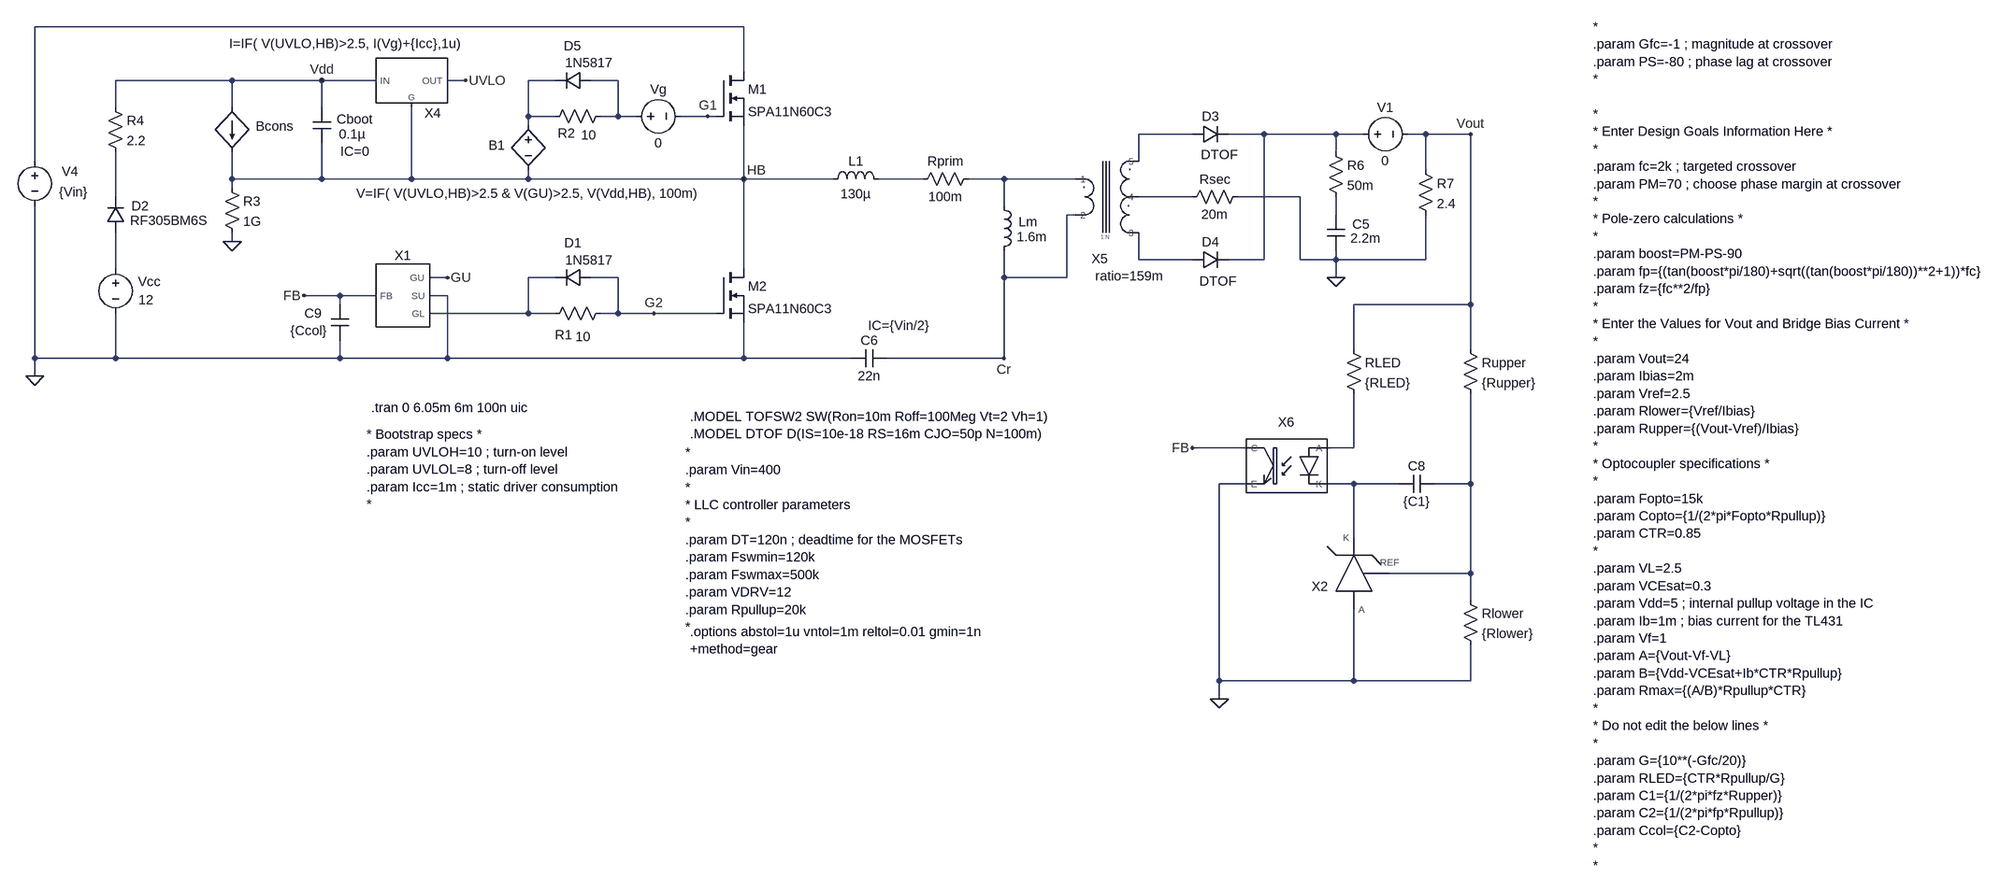
[diagram p0: schematic LLC VM cbc - bootstrap.asc]
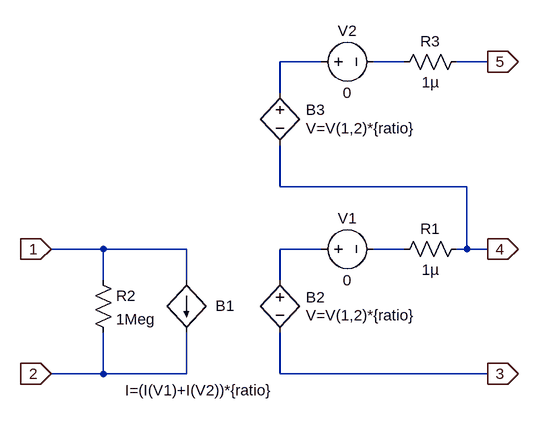
[diagram p1: sub-circuit xfmr_ctap.asc]
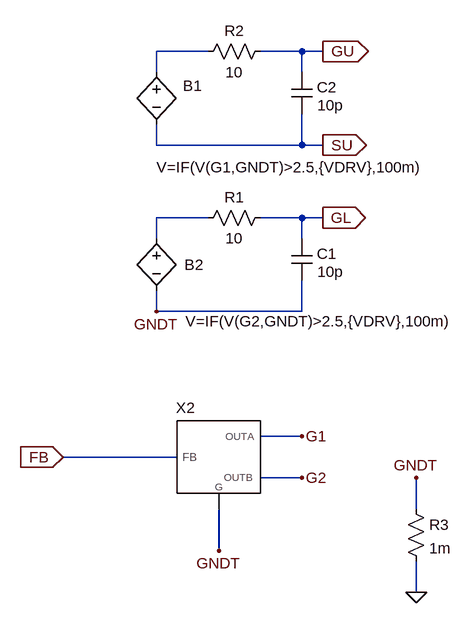
[diagram p2: sub-circuit generic_llc_vm.asc]
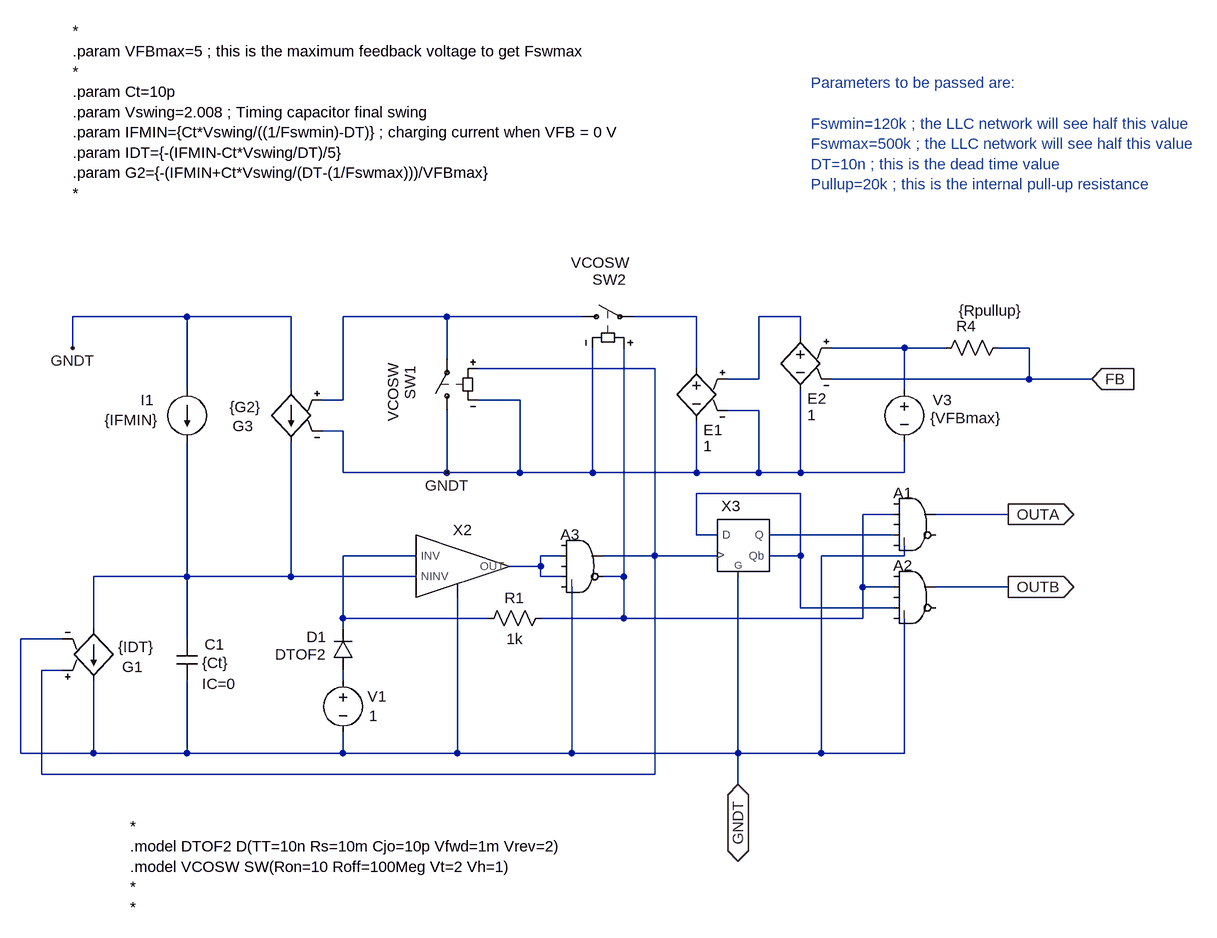
[diagram p3: sub-circuit vco_pulldown_subckt.asc]
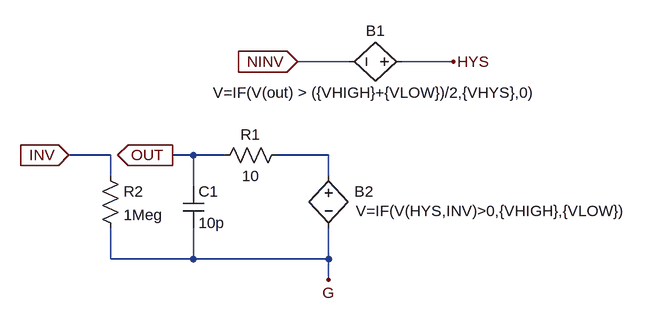
[diagram p4: sub-circuit comptof_g.asc]
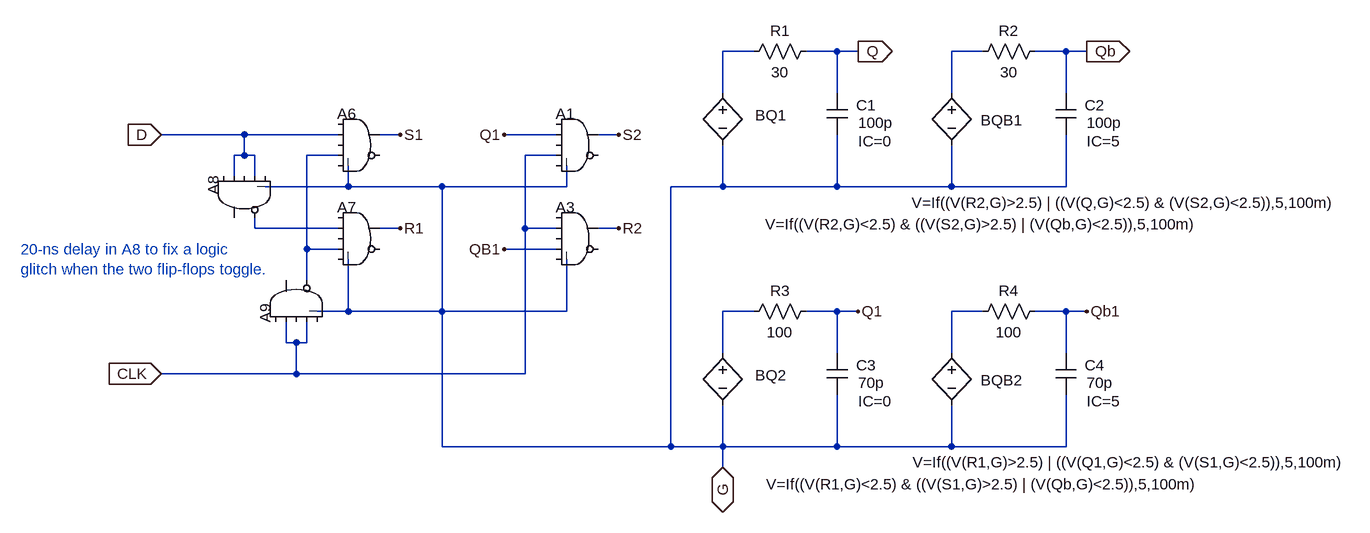
[diagram p5: sub-circuit d_flipflop_g.asc]
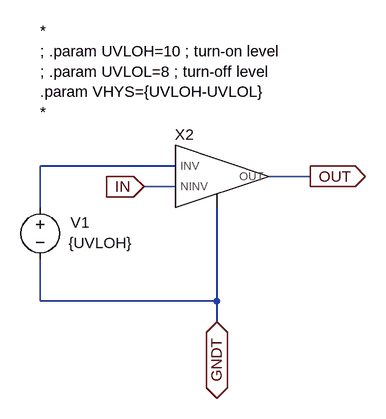
[diagram p6: sub-circuit uvlo.asc]
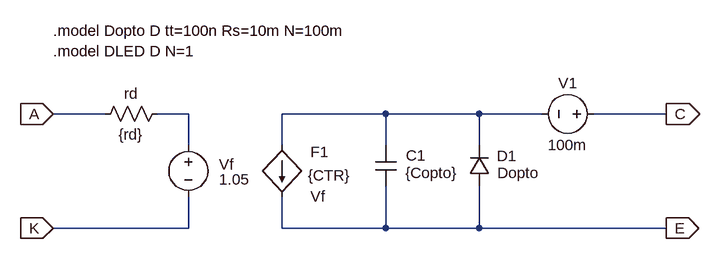
[diagram p7: sub-circuit optotof.asc]
LLC VM cbc - bootstrap.asc, the LTspice schematic file:
Version 4.1
SHEET 1 3260 680
WIRE -1008 -832 -2272 -832
WIRE -1008 -752 -1008 -832
WIRE -1920 -736 -2128 -736
WIRE -1760 -736 -1920 -736
WIRE -1664 -736 -1760 -736
WIRE -1504 -736 -1536 -736
WIRE -1344 -736 -1392 -736
WIRE -1232 -736 -1280 -736
WIRE -2128 -688 -2128 -736
WIRE -1920 -688 -1920 -736
WIRE -1760 -688 -1760 -736
WIRE -1392 -672 -1392 -736
WIRE -1344 -672 -1392 -672
WIRE -1232 -672 -1232 -736
WIRE -1232 -672 -1264 -672
WIRE -1200 -672 -1232 -672
WIRE -1072 -672 -1120 -672
WIRE -1056 -672 -1072 -672
WIRE -1392 -656 -1392 -672
WIRE -208 -640 -304 -640
WIRE -80 -640 -144 -640
WIRE 48 -640 -80 -640
WIRE 96 -640 48 -640
WIRE 208 -640 176 -640
WIRE 288 -640 208 -640
WIRE 48 -608 48 -640
WIRE -2272 -592 -2272 -832
WIRE -304 -592 -304 -640
WIRE 208 -576 208 -640
WIRE -1920 -560 -1920 -608
WIRE -1760 -560 -1760 -624
WIRE -1760 -560 -1920 -560
WIRE -1600 -560 -1600 -688
WIRE -1600 -560 -1760 -560
WIRE -1392 -560 -1392 -576
WIRE -1392 -560 -1600 -560
WIRE -1008 -560 -1008 -656
WIRE -1008 -560 -1392 -560
WIRE -848 -560 -1008 -560
WIRE -688 -560 -768 -560
WIRE -544 -560 -608 -560
WIRE -416 -560 -544 -560
WIRE -1920 -544 -1920 -560
WIRE -2128 -528 -2128 -608
WIRE -208 -528 -304 -528
WIRE -16 -528 -128 -528
WIRE -544 -512 -544 -560
WIRE -416 -496 -432 -496
WIRE 48 -496 48 -528
WIRE -1920 -448 -1920 -464
WIRE -304 -416 -304 -464
WIRE -208 -416 -304 -416
WIRE -80 -416 -80 -640
WIRE -80 -416 -144 -416
WIRE -16 -416 -16 -528
WIRE 48 -416 48 -432
WIRE 48 -416 -16 -416
WIRE 208 -416 208 -496
WIRE 208 -416 48 -416
WIRE -2128 -400 -2128 -464
WIRE -1008 -400 -1008 -560
WIRE -1536 -384 -1568 -384
WIRE -1344 -384 -1392 -384
WIRE -1232 -384 -1280 -384
WIRE -544 -384 -544 -432
WIRE -432 -384 -432 -496
WIRE -432 -384 -544 -384
WIRE 48 -384 48 -416
WIRE -1728 -352 -1792 -352
WIRE -1664 -352 -1728 -352
WIRE -1536 -352 -1568 -352
WIRE -1728 -336 -1728 -352
WIRE 288 -336 288 -640
WIRE 288 -336 80 -336
WIRE -1392 -320 -1392 -384
WIRE -1392 -320 -1568 -320
WIRE -1344 -320 -1392 -320
WIRE -1232 -320 -1232 -384
WIRE -1232 -320 -1264 -320
WIRE -1168 -320 -1232 -320
WIRE -1056 -320 -1168 -320
WIRE 80 -256 80 -336
WIRE 288 -256 288 -336
WIRE -2272 -240 -2272 -512
WIRE -2128 -240 -2128 -320
WIRE -2128 -240 -2272 -240
WIRE -1728 -240 -1728 -272
WIRE -1728 -240 -2128 -240
WIRE -1536 -240 -1536 -352
WIRE -1536 -240 -1728 -240
WIRE -1008 -240 -1008 -304
WIRE -1008 -240 -1536 -240
WIRE -816 -240 -1008 -240
WIRE -544 -240 -544 -384
WIRE -544 -240 -752 -240
WIRE -2272 -208 -2272 -240
WIRE -112 -80 -208 -80
WIRE 80 -80 80 -176
WIRE 80 -80 32 -80
WIRE -112 -16 -160 -16
WIRE 80 -16 32 -16
WIRE 160 -16 80 -16
WIRE 288 -16 288 -176
WIRE 288 -16 224 -16
WIRE 80 80 80 -16
WIRE 288 144 288 -16
WIRE 288 144 144 144
WIRE 288 192 288 144
WIRE -160 336 -160 -16
WIRE 80 336 80 208
WIRE 80 336 -160 336
WIRE 288 336 288 272
WIRE 288 336 80 336
WIRE -160 368 -160 336
FLAG -1792 -352 FB
FLAG 48 -384 0
FLAG 288 -640 Vout
FLAG -1008 -560 HB
FLAG -544 -240 Cr
FLAG -2272 -208 0
FLAG -208 -80 FB
FLAG -160 368 0
FLAG -1536 -384 GU
FLAG -1760 -736 Vdd
FLAG -1168 -320 G2
FLAG -1920 -448 0
FLAG -1504 -736 UVLO
FLAG -1072 -672 G1
SYMBOL diode -208 -624 R270
WINDOW 0 32 32 VTop 2
WINDOW 3 -5 48 VBottom 2
SYMATTR InstName D3
SYMATTR Value DTOF
SYMBOL diode -208 -400 R270
WINDOW 0 32 32 VTop 2
WINDOW 3 -7 46 VBottom 2
SYMATTR InstName D4
SYMATTR Value DTOF
SYMBOL res 32 -624 R0
SYMATTR InstName R6
SYMATTR Value 50m
SYMBOL cap 32 -496 R0
WINDOW 0 45 17 Left 2
WINDOW 3 42 42 Left 2
SYMATTR InstName C5
SYMATTR Value 2.2m
SYMBOL res 192 -592 R0
SYMATTR InstName R7
SYMATTR Value 2.4
SYMBOL res -112 -544 R90
WINDOW 0 0 56 VBottom 2
WINDOW 3 32 56 VTop 2
SYMATTR InstName Rsec
SYMATTR Value 20m
SYMBOL ind -560 -528 R0
WINDOW 0 42 45 Left 2
WINDOW 3 39 71 Left 2
SYMATTR InstName Lm
SYMATTR Value 1.6m
SYMBOL cap -752 -256 R90
WINDOW 0 0 32 VBottom 2
WINDOW 3 32 32 VTop 2
WINDOW 123 -27 -21 VBottom 2
SYMATTR InstName C6
SYMATTR Value 22n
SYMATTR Value2 IC={Vin/2}
SYMBOL res -592 -576 R90
WINDOW 0 0 56 VBottom 2
WINDOW 3 32 56 VTop 2
SYMATTR InstName Rprim
SYMATTR Value 100m
SYMBOL ind -864 -544 R270
WINDOW 0 32 56 VTop 2
WINDOW 3 5 56 VBottom 2
SYMATTR InstName L1
SYMATTR Value 130µ
SYMBOL voltage -2272 -608 R0
WINDOW 0 48 35 Left 2
WINDOW 3 43 71 Left 2
SYMATTR InstName V4
SYMATTR Value {Vin}
SYMBOL XFMR_CTap -352 -544 R0
WINDOW 0 -21 142 Bottom 2
WINDOW 39 32 173 Bottom 2
SYMATTR InstName X5
SYMATTR SpiceLine ratio=159m
SYMBOL res 272 176 R0
SYMATTR InstName Rlower
SYMATTR Value {Rlower}
SYMBOL res 272 -272 R0
SYMATTR InstName Rupper
SYMATTR Value {Rupper}
SYMBOL res 64 -272 R0
SYMATTR InstName RLED
SYMATTR Value {RLED}
SYMBOL cap 224 -32 R90
WINDOW 0 0 32 VBottom 2
WINDOW 3 32 32 VTop 2
SYMATTR InstName C8
SYMATTR Value {C1}
SYMBOL cap -1712 -336 M0
WINDOW 0 48 16 Left 2
WINDOW 3 40 47 Left 2
SYMATTR InstName C9
SYMATTR Value {Ccol}
SYMBOL voltage 80 -640 R270
WINDOW 0 32 56 VTop 2
WINDOW 3 -32 56 VBottom 2
SYMATTR InstName V1
SYMATTR Value 0
SYMBOL voltage -2128 -416 R0
WINDOW 0 40 39 Left 2
WINDOW 3 41 72 Left 2
SYMATTR InstName Vcc
SYMATTR Value 12
SYMBOL nmos -1056 -752 R0
SYMATTR InstName M1
SYMATTR Value SPA11N60C3
SYMBOL nmos -1056 -400 R0
SYMATTR InstName M2
SYMATTR Value SPA11N60C3
SYMBOL res -1248 -336 R90
WINDOW 0 70 81 VBottom 2
WINDOW 3 42 46 VTop 2
SYMATTR InstName R1
SYMATTR Value 10
SYMBOL diode -1280 -400 R90
WINDOW 0 -30 32 VBottom 2
WINDOW 3 -31 4 VTop 2
SYMATTR InstName D1
SYMATTR Value 1N5817
SYMBOL diode -2112 -464 R180
WINDOW 0 -43 48 Left 2
WINDOW 3 -148 22 Left 2
SYMATTR InstName D2
SYMATTR Value RF305BM6S
SYMBOL res -1248 -688 R90
WINDOW 0 62 76 VBottom 2
WINDOW 3 34 36 VTop 2
SYMATTR InstName R2
SYMATTR Value 10
SYMBOL diode -1280 -752 R90
WINDOW 0 -30 33 VBottom 2
WINDOW 3 -31 4 VTop 2
SYMATTR InstName D5
SYMATTR Value 1N5817
SYMBOL bv -1392 -672 R0
WINDOW 0 -71 52 Left 2
WINDOW 3 -307 138 Left 2
SYMATTR InstName B1
SYMATTR Value V=IF( V(UVLO,HB)>2.5 & V(GU)>2.5, V(Vdd,HB), 100m)
SYMBOL cap -1744 -624 R180
WINDOW 0 -75 43 Left 2
WINDOW 3 -62 16 Left 2
WINDOW 123 -69 -15 Left 2
SYMATTR InstName Cboot
SYMATTR Value 0.1µ
SYMATTR Value2 IC=0
SYMBOL voltage -1216 -672 R270
WINDOW 0 32 56 VTop 2
WINDOW 3 -32 56 VBottom 2
SYMATTR InstName Vg
SYMATTR Value 0
SYMBOL res -1936 -560 R0
SYMATTR InstName R3
SYMATTR Value 1G
SYMBOL res -2144 -704 R0
SYMATTR InstName R4
SYMATTR Value 2.2
SYMBOL bi -1920 -688 R0
WINDOW 0 42 34 Left 2
WINDOW 3 -5 -114 Left 2
SYMATTR InstName Bcons
SYMATTR Value I=IF( V(UVLO,HB)>2.5, I(Vg)+{Icc},1u)
SYMBOL TOF\\Subcircuits\\Generic_LLC_VM -1616 -352 R0
SYMATTR InstName X1
SYMATTR SpiceLine Fswmin={Fswmin} Fswmax={Fswmax} DT={DT} Rpullup={Rpullup} VDRV={VDRV}
SYMBOL TOF\\Subcircuits\\UVLO -1600 -736 R0
WINDOW 0 38 74 Bottom 2
SYMATTR InstName X4
SYMATTR SpiceLine UVLOH={UVLOH} UVLOL={UVLOL}
SYMBOL TOF\\Subcircuits\\optoTOF -80 -48 M0
SYMATTR InstName X6
SYMATTR SpiceLine rd=100 CTR={CTR} Copto={Copto}
SYMBOL TOF\\Subcircuits\\TL431TOF 64 96 R0
WINDOW 0 -45 87 Bottom 2
SYMATTR InstName X2
TEXT -1672 -152 Left 2 !.tran 0 6.05m 6m 100n uic
TEXT -1104 -136 Left 2 !.MODEL TOFSW2 SW(Ron=10m Roff=100Meg Vt=2 Vh=1)\n.MODEL DTOF D(IS=10e-18 RS=16m CJO=50p N=100m)
TEXT -1112 -72 Left 2 !*\n.param Vin=400\n*\n* LLC controller parameters\n*\n.param DT=120n ; deadtime for the MOSFETs\n.param Fswmin=120k\n.param Fswmax=500k\n.param VDRV=12\n.param Rpullup=20k\n*
TEXT -1104 248 Left 2 !.options abstol=1u vntol=1m reltol=0.01 gmin=1n\n+method=gear
TEXT 520 -832 Left 2 !*\n.param Gfc=-1 ; magnitude at crossover\n.param PS=-80 ; phase lag at crossover\n*\n \n*\n* Enter Design Goals Information Here *\n*\n.param fc=2k ; targeted crossover\n.param PM=70 ; choose phase margin at crossover\n*\n* Pole-zero calculations *\n*\n.param boost=PM-PS-90\n.param fp={(tan(boost*pi/180)+sqrt((tan(boost*pi/180))**2+1))*fc}\n.param fz={fc**2/fp}\n*\n* Enter the Values for Vout and Bridge Bias Current *\n*\n.param Vout=24\n.param Ibias=2m\n.param Vref=2.5\n.param Rlower={Vref/Ibias}\n.param Rupper={(Vout-Vref)/Ibias}\n*\n* Optocoupler specifications *\n*\n.param Fopto=15k\n.param Copto={1/(2*pi*Fopto*Rpullup)}\n.param CTR=0.85\n*\n.param VL=2.5\n.param VCEsat=0.3\n.param Vdd=5 ; internal pullup voltage in the IC\n.param Ib=1m ; bias current for the TL431\n.param Vf=1\n.param A={Vout-Vf-VL}\n.param B={Vdd-VCEsat+Ib*CTR*Rpullup}\n.param Rmax={(A/B)*Rpullup*CTR}\n*\n* Do not edit the below lines *\n*\n.param G={10**(-Gfc/20)}\n.param RLED={CTR*Rpullup/G}\n.param C1={1/(2*pi*fz*Rupper)}\n.param C2={1/(2*pi*fp*Rpullup)}\n.param Ccol={C2-Copto}\n*\n*
TEXT -1680 -104 Left 2 !* Bootstrap specs *\n.param UVLOH=10 ; turn-on level\n.param UVLOL=8 ; turn-off level\n.param Icc=1m ; static driver consumption\n*

xfmr_ctap.asc, the sub-circuit schematic file:
Version 4
SHEET 1 880 680
WIRE 368 -192 304 -192
WIRE 496 -192 448 -192
WIRE 624 -192 576 -192
WIRE 304 -144 304 -192
WIRE 304 0 304 -64
WIRE 592 0 304 0
WIRE 32 96 -48 96
WIRE 160 96 32 96
WIRE 368 96 304 96
WIRE 496 96 448 96
WIRE 592 96 592 0
WIRE 592 96 576 96
WIRE 624 96 592 96
WIRE 32 144 32 96
WIRE 160 144 160 96
WIRE 304 144 304 96
WIRE 32 288 32 224
WIRE 32 288 -48 288
WIRE 160 288 160 224
WIRE 160 288 32 288
WIRE 304 288 304 224
WIRE 624 288 304 288
FLAG 624 96 4
IOPIN 624 96 Out
FLAG 624 288 3
IOPIN 624 288 Out
FLAG -48 96 1
IOPIN -48 96 In
FLAG -48 288 2
IOPIN -48 288 In
FLAG 624 -192 5
IOPIN 624 -192 Out
SYMBOL bi 160 144 R0
WINDOW 0 45 39 Left 2
WINDOW 3 -94 169 Left 2
SYMATTR InstName B1
SYMATTR Value I=(I(V1)+I(V2))*{ratio}
SYMBOL bv 304 128 R0
WINDOW 0 40 42 Left 2
WINDOW 3 40 70 Left 2
SYMATTR InstName B2
SYMATTR Value V=V(1,2)*{ratio}
SYMBOL voltage 352 96 R270
WINDOW 0 32 56 VTop 2
WINDOW 3 -32 56 VBottom 2
WINDOW 123 0 0 Left 0
WINDOW 39 0 0 Left 0
SYMATTR InstName V1
SYMATTR Value 0
SYMBOL res 592 80 R90
WINDOW 0 0 56 VBottom 2
WINDOW 3 32 56 VTop 2
SYMATTR InstName R1
SYMATTR Value 1µ
SYMBOL res 16 128 R0
SYMATTR InstName R2
SYMATTR Value 1Meg
SYMBOL bv 304 -160 R0
WINDOW 0 40 42 Left 2
WINDOW 3 40 70 Left 2
SYMATTR InstName B3
SYMATTR Value V=V(1,2)*{ratio}
SYMBOL voltage 352 -192 R270
WINDOW 0 32 56 VTop 2
WINDOW 3 -32 56 VBottom 2
WINDOW 123 0 0 Left 0
WINDOW 39 0 0 Left 0
SYMATTR InstName V2
SYMATTR Value 0
SYMBOL res 592 -208 R90
WINDOW 0 0 56 VBottom 2
WINDOW 3 32 56 VTop 2
SYMATTR InstName R3
SYMATTR Value 1µ

generic_llc_vm.asc, the sub-circuit schematic file:
Version 4.1
SHEET 1 880 680
WIRE 112 -448 32 -448
WIRE 256 -448 192 -448
WIRE 288 -448 256 -448
WIRE 32 -416 32 -448
WIRE 256 -416 256 -448
WIRE 32 -304 32 -336
WIRE 256 -304 256 -352
WIRE 256 -304 32 -304
WIRE 288 -304 256 -304
WIRE 112 -192 32 -192
WIRE 256 -192 192 -192
WIRE 288 -192 256 -192
WIRE 32 -160 32 -192
WIRE 256 -160 256 -192
WIRE 32 -48 32 -80
WIRE 256 -48 256 -96
WIRE 256 -48 32 -48
WIRE 256 144 192 144
WIRE 64 176 -112 176
WIRE 256 208 192 208
WIRE 432 256 432 208
WIRE 128 320 128 256
WIRE 432 384 432 336
FLAG -112 176 FB
IOPIN -112 176 In
FLAG 128 320 GNDT
FLAG 32 -48 GNDT
FLAG 288 -192 GL
IOPIN 288 -192 Out
FLAG 288 -448 GU
IOPIN 288 -448 Out
FLAG 288 -304 SU
IOPIN 288 -304 Out
FLAG 256 144 G1
FLAG 256 208 G2
FLAG 432 384 0
FLAG 432 208 GNDT
SYMBOL bv 32 -432 R0
WINDOW 0 41 37 Left 2
WINDOW 3 0 162 Left 2
SYMATTR InstName B1
SYMATTR Value V=IF(V(G1,GNDT)>2.5,{VDRV},100m)
SYMBOL bv 32 -176 R0
WINDOW 0 43 56 Left 2
WINDOW 3 45 143 Left 2
SYMATTR InstName B2
SYMATTR Value V=IF(V(G2,GNDT)>2.5,{VDRV},100m)
SYMBOL res 208 -208 R90
WINDOW 0 0 56 VBottom 2
WINDOW 3 32 56 VTop 2
SYMATTR InstName R1
SYMATTR Value 10
SYMBOL cap 240 -160 R0
WINDOW 0 39 23 Left 2
WINDOW 3 40 51 Left 2
SYMATTR InstName C1
SYMATTR Value 10p
SYMBOL res 208 -464 R90
WINDOW 0 0 56 VBottom 2
WINDOW 3 32 56 VTop 2
SYMATTR InstName R2
SYMATTR Value 10
SYMBOL cap 240 -416 R0
WINDOW 0 39 23 Left 2
WINDOW 3 40 51 Left 2
SYMATTR InstName C2
SYMATTR Value 10p
SYMBOL res 416 240 R0
SYMATTR InstName R3
SYMATTR Value 1m
SYMBOL TOF\\Subcircuits\\VCO_pulldown_subckt 128 176 R0
WINDOW 0 -51 -60 Bottom 2
SYMATTR InstName X2
SYMATTR SpiceLine Fswmin={Fswmin} Fswmax={Fswmax} Rpullup={Rpullup} DT={DT}

vco_pulldown_subckt.asc, the sub-circuit schematic file:
Version 4.1
SHEET 1 1284 752
WIRE -656 -160 -832 -160
WIRE -496 -160 -656 -160
WIRE -256 -160 -416 -160
WIRE -48 -160 -256 -160
WIRE 128 -160 32 -160
WIRE 288 -160 224 -160
WIRE 288 -128 288 -160
WIRE -832 -112 -832 -160
WIRE 448 -112 336 -112
WIRE 512 -112 448 -112
WIRE 640 -112 592 -112
WIRE -256 -96 -256 -160
WIRE 64 -80 -208 -80
WIRE 128 -80 128 -160
WIRE 224 -64 224 -160
WIRE 224 -64 176 -64
WIRE 640 -64 640 -112
WIRE 640 -64 336 -64
WIRE 736 -64 640 -64
WIRE -656 -48 -656 -160
WIRE -496 -48 -496 -160
WIRE 448 -48 448 -112
WIRE -416 -32 -416 -160
WIRE -416 -32 -448 -32
WIRE -144 -32 -208 -32
WIRE 224 -16 176 -16
WIRE -416 16 -448 16
WIRE -416 80 -416 16
WIRE -256 80 -256 -16
WIRE -256 80 -416 80
WIRE -144 80 -144 -32
WIRE -144 80 -256 80
WIRE -32 80 -32 -112
WIRE -32 80 -144 80
WIRE 128 80 128 0
WIRE 128 80 -32 80
WIRE 224 80 224 -16
WIRE 224 80 128 80
WIRE 288 80 288 -48
WIRE 288 80 224 80
WIRE 448 80 448 32
WIRE 448 80 288 80
WIRE 288 112 128 112
WIRE 432 144 384 144
WIRE 608 144 496 144
WIRE 128 176 128 112
WIRE 160 176 128 176
WIRE 432 176 240 176
WIRE -304 208 -416 208
WIRE -80 208 -112 208
WIRE 64 208 64 -80
WIRE 64 208 -16 208
WIRE 160 208 64 208
WIRE 288 208 288 112
WIRE 288 208 240 208
WIRE 448 208 448 192
WIRE 448 208 320 208
WIRE -112 224 -112 208
WIRE -112 224 -160 224
WIRE -656 240 -656 32
WIRE -656 240 -800 240
WIRE -496 240 -496 32
WIRE -496 240 -656 240
WIRE -304 240 -496 240
WIRE -112 240 -112 224
WIRE -80 240 -112 240
WIRE 16 240 16 -112
WIRE 16 240 -16 240
WIRE 384 256 384 144
WIRE 432 256 384 256
WIRE 608 256 496 256
WIRE 288 288 288 208
WIRE 432 288 288 288
WIRE -416 304 -416 208
WIRE -192 304 -416 304
WIRE 16 304 16 240
WIRE 16 304 -112 304
WIRE 384 304 384 256
WIRE 384 304 16 304
WIRE -800 320 -800 240
WIRE -416 320 -416 304
WIRE -848 336 -912 336
WIRE -656 336 -656 240
WIRE -848 384 -880 384
WIRE -416 400 -416 384
WIRE -912 512 -912 336
WIRE -800 512 -800 400
WIRE -800 512 -912 512
WIRE -656 512 -656 400
WIRE -656 512 -800 512
WIRE -416 512 -416 480
WIRE -416 512 -656 512
WIRE -240 512 -240 272
WIRE -240 512 -416 512
WIRE -64 512 -64 256
WIRE -64 512 -240 512
WIRE 192 512 192 240
WIRE 192 512 -64 512
WIRE 320 512 320 208
WIRE 320 512 192 512
WIRE 448 512 448 304
WIRE 448 512 320 512
WIRE -880 544 -880 384
WIRE 64 544 64 208
WIRE 64 544 -880 544
WIRE 192 560 192 512
FLAG 608 144 OUTA
IOPIN 608 144 Out
FLAG 608 256 OUTB
IOPIN 608 256 Out
FLAG 192 560 GNDT
IOPIN 192 560 BiDir
FLAG -832 -112 GNDT
FLAG -256 80 GNDT
FLAG 736 -64 FB
IOPIN 736 -64 In
SYMBOL Digital\\and 464 96 R0
WINDOW 0 -33 15 Left 2
SYMATTR InstName A1
SYMATTR SpiceLine Vhigh=5 Vlow=0 Ref=2.5
SYMBOL Digital\\and 464 208 R0
WINDOW 0 -33 15 Left 2
SYMATTR InstName A2
SYMATTR SpiceLine Vhigh=5 Vlow=0 Ref=2.5
SYMBOL Digital\\and -48 160 R0
WINDOW 0 -33 15 Left 2
SYMATTR InstName A3
SYMATTR SpiceLine Vhigh=5 Vlow=0 Ref=2.5
SYMBOL voltage -416 384 R0
WINDOW 0 38 40 Left 2
WINDOW 3 40 70 Left 2
SYMATTR InstName V1
SYMATTR Value 1
SYMBOL diode -400 384 R180
WINDOW 0 41 51 Left 2
WINDOW 3 41 24 Left 2
SYMATTR InstName D1
SYMATTR Value DTOF2
SYMBOL res -96 288 R90
WINDOW 0 0 56 VBottom 2
WINDOW 3 32 56 VTop 2
SYMATTR InstName R1
SYMATTR Value 1k
SYMBOL g -800 416 M180
WINDOW 0 44 37 Left 2
WINDOW 3 38 68 Left 2
SYMATTR InstName G1
SYMATTR Value {IDT}
SYMBOL cap -672 336 R0
WINDOW 0 43 8 Left 2
WINDOW 3 39 37 Left 2
WINDOW 39 39 69 Left 2
SYMATTR InstName C1
SYMATTR Value {Ct}
SYMATTR SpiceLine IC=0
SYMBOL current -656 -48 M0
WINDOW 0 51 16 Left 2
WINDOW 3 44 47 Left 2
SYMATTR InstName I1
SYMATTR Value {IFMIN}
SYMBOL sw -256 0 R180
WINDOW 3 83 89 VLeft 2
WINDOW 0 57 84 VLeft 2
SYMATTR Value VCOSW
SYMATTR InstName SW1
SYMBOL g2 -496 48 R180
WINDOW 0 58 40 Left 2
WINDOW 3 46 69 Left 2
SYMATTR InstName G3
SYMATTR Value {G2}
SYMBOL sw -64 -160 R270
WINDOW 3 83 89 VLeft 2
WINDOW 0 57 84 VLeft 2
SYMATTR Value VCOSW
SYMATTR InstName SW2
SYMBOL e 128 -96 M0
WINDOW 0 -40 110 Left 2
WINDOW 3 -24 135 Left 2
SYMATTR InstName E1
SYMATTR Value 1
SYMBOL e 288 -144 M0
WINDOW 0 -40 110 Left 2
WINDOW 3 -24 135 Left 2
SYMATTR InstName E2
SYMATTR Value 1
SYMBOL voltage 448 -64 R0
WINDOW 0 44 32 Left 2
WINDOW 3 40 60 Left 2
SYMATTR InstName V3
SYMATTR Value {VFBmax}
SYMBOL res 608 -128 R90
WINDOW 0 -2 65 VBottom 2
WINDOW 3 -57 27 VTop 2
SYMATTR InstName R4
SYMATTR Value {Rpullup}
SYMBOL TOF\\Subcircuits\\COMPTOF_G -240 224 R0
SYMATTR InstName X2
SYMATTR SpiceLine VHIGH=5 VLOW=1m VHYS=1u
SYMBOL TOF\\Subcircuits\\D_FlipFlop_G 192 192 R0
WINDOW 0 -11 -45 Bottom 2
SYMATTR InstName X3
TEXT -744 624 Left 2 !*\n.model DTOF2 D(TT=10n Rs=10m Cjo=10p Vfwd=1m Vrev=2)\n.model VCOSW SW(Ron=10 Roff=100Meg Vt=2 Vh=1)\n*\n*
TEXT -832 -600 Left 2 !*\n.param VFBmax=5 ; this is the maximum feedback voltage to get Fswmax\n*\n.param Ct=10p\n.param Vswing=2.008 ; Timing capacitor final swing\n.param IFMIN={Ct*Vswing/((1/Fswmin)-DT)} ; charging current when VFB = 0 V\n.param IDT={-(IFMIN-Ct*Vswing/DT)/5}\n.param G2={-(IFMIN+Ct*Vswing/(DT-(1/Fswmax)))/VFBmax}\n*
TEXT 304 -520 Left 2 ;Parameters to be passed are:\n \nFswmin=120k ; the LLC network will see half this value\nFswmax=500k ; the LLC network will see half this value\nDT=10n ; this is the dead time value\nPullup=20k ; this is the internal pull-up resistance

comptof_g.asc, the sub-circuit schematic file:
Version 4.1
SHEET 1 880 680
WIRE 64 192 -16 192
WIRE 224 192 144 192
WIRE -304 336 -368 336
WIRE -176 336 -208 336
WIRE -128 336 -176 336
WIRE 32 336 -48 336
WIRE -304 368 -304 336
WIRE 32 368 32 336
WIRE -176 384 -176 336
WIRE -304 496 -304 448
WIRE -176 496 -176 448
WIRE -176 496 -304 496
WIRE 32 496 32 448
WIRE 32 496 -176 496
WIRE 32 528 32 496
FLAG -16 192 NINV
IOPIN -16 192 In
FLAG 224 192 HYS
FLAG -208 336 OUT
IOPIN -208 336 Out
FLAG -368 336 INV
IOPIN -368 336 In
FLAG 32 528 G
SYMBOL bv 160 192 R90
WINDOW 0 -32 56 VBottom 2
WINDOW 3 32 56 VTop 2
SYMATTR InstName B1
SYMATTR Value V=IF(V(out) > ({VHIGH}+{VLOW})/2,{VHYS},0)
SYMBOL bv 32 352 R0
WINDOW 0 40 40 Left 2
WINDOW 3 42 70 Left 2
SYMATTR InstName B2
SYMATTR Value V=IF(V(HYS,INV)>0,{VHIGH},{VLOW})
SYMBOL res -32 320 R90
WINDOW 0 0 56 VBottom 2
WINDOW 3 32 56 VTop 2
SYMATTR InstName R1
SYMATTR Value 10
SYMBOL cap -192 384 R0
SYMATTR InstName C1
SYMATTR Value 10p
SYMBOL res -320 352 R0
SYMATTR InstName R2
SYMATTR Value 1Meg

d_flipflop_g.asc, the sub-circuit schematic file:
Version 4.1
SHEET 1 1820 1368
WIRE 768 448 720 448
WIRE 896 448 848 448
WIRE 928 448 896 448
WIRE 1120 448 1072 448
WIRE 1248 448 1200 448
WIRE 1280 448 1248 448
WIRE 720 512 720 448
WIRE 896 512 896 448
WIRE 1072 512 1072 448
WIRE 1248 512 1248 448
WIRE -16 576 -144 576
WIRE 128 576 -16 576
WIRE 224 576 192 576
WIRE 464 576 384 576
WIRE 560 576 528 576
WIRE -16 608 -16 576
WIRE -16 608 -32 608
WIRE 0 608 -16 608
WIRE 128 608 80 608
WIRE 464 608 416 608
WIRE -32 640 -32 608
WIRE 0 640 0 608
WIRE 144 656 144 624
WIRE 144 656 16 656
WIRE 288 656 144 656
WIRE 480 656 480 624
WIRE 480 656 288 656
WIRE 720 656 720 592
WIRE 720 656 640 656
WIRE 896 656 896 576
WIRE 896 656 720 656
WIRE 1072 656 1072 592
WIRE 1072 656 896 656
WIRE 1248 656 1248 576
WIRE 1248 656 1072 656
WIRE 0 720 0 704
WIRE 128 720 0 720
WIRE 224 720 192 720
WIRE 416 720 416 608
WIRE 464 720 416 720
WIRE 560 720 528 720
WIRE 80 752 80 608
WIRE 128 752 80 752
WIRE 464 752 384 752
WIRE 80 800 80 752
WIRE 144 848 144 768
WIRE 144 848 96 848
WIRE 288 848 288 656
WIRE 288 848 144 848
WIRE 480 848 480 768
WIRE 480 848 288 848
WIRE 768 848 720 848
WIRE 896 848 848 848
WIRE 928 848 896 848
WIRE 1120 848 1072 848
WIRE 1248 848 1200 848
WIRE 1280 848 1248 848
WIRE 48 896 48 864
WIRE 64 896 48 896
WIRE 80 896 80 864
WIRE 80 896 64 896
WIRE 720 912 720 848
WIRE 896 912 896 848
WIRE 1072 912 1072 848
WIRE 1248 912 1248 848
WIRE 64 944 64 896
WIRE 64 944 -144 944
WIRE 416 944 416 720
WIRE 416 944 64 944
WIRE 288 1056 288 848
WIRE 640 1056 640 656
WIRE 640 1056 288 1056
WIRE 720 1056 720 992
WIRE 720 1056 640 1056
WIRE 896 1056 896 976
WIRE 896 1056 720 1056
WIRE 1072 1056 1072 992
WIRE 1072 1056 896 1056
WIRE 1248 1056 1248 976
WIRE 1248 1056 1072 1056
WIRE 720 1088 720 1056
FLAG -144 576 D
IOPIN -144 576 In
FLAG -144 944 CLK
IOPIN -144 944 In
FLAG 560 576 S2
FLAG 560 720 R2
FLAG 928 448 Q
IOPIN 928 448 Out
FLAG 1280 448 Qb
IOPIN 1280 448 Out
FLAG 224 576 S1
FLAG 224 720 R1
FLAG 384 576 Q1
FLAG 384 752 QB1
FLAG 928 848 Q1
FLAG 1280 848 Qb1
FLAG 720 1088 G
IOPIN 720 1088 BiDir
SYMBOL Digital\\and 496 528 R0
WINDOW 0 -33 16 Left 2
SYMATTR InstName A1
SYMATTR SpiceLine Vhigh=5 Vlow=100m Ref=2.5
SYMBOL Digital\\and 496 672 R0
WINDOW 0 -33 16 Left 2
SYMATTR InstName A3
SYMATTR SpiceLine Vhigh=5 Vlow=100m Ref=2.5
SYMBOL Digital\\and 160 528 R0
WINDOW 0 -33 16 Left 2
SYMATTR InstName A6
SYMATTR SpiceLine Vhigh=5 Vlow=100m Ref=2.5
SYMBOL Digital\\and 160 672 R0
WINDOW 0 -33 16 Left 2
SYMATTR InstName A7
SYMATTR SpiceLine Vhigh=5 Vlow=100m Ref=2.5
SYMBOL Digital\\and -80 672 M90
WINDOW 0 -33 16 Left 2
SYMATTR InstName A8
SYMATTR SpiceLine Vhigh=5 Vlow=100m Ref=2.5 Td=20n
SYMBOL Digital\\and 0 832 R270
WINDOW 0 -33 16 Left 2
SYMATTR InstName A9
SYMATTR SpiceLine Vhigh=5 Vlow=100m Ref=2.5
SYMBOL bv 720 496 R0
WINDOW 0 50 50 Left 2
WINDOW 3 65 218 Left 2
SYMATTR InstName BQ1
SYMATTR Value V=If((V(R2,G)<2.5) & ((V(S2,G)>2.5) | (V(Qb,G)<2.5)),5,100m)
SYMBOL res 864 432 R90
WINDOW 0 0 56 VBottom 2
WINDOW 3 32 56 VTop 2
SYMATTR InstName R1
SYMATTR Value 30
SYMBOL cap 880 512 R0
WINDOW 0 45 19 Left 2
WINDOW 3 48 46 Left 2
WINDOW 123 48 74 Left 2
SYMATTR InstName C1
SYMATTR Value 100p
SYMATTR Value2 IC=0
SYMBOL bv 1072 496 R0
WINDOW 0 45 58 Left 2
WINDOW 3 -61 185 Left 2
SYMATTR InstName BQB1
SYMATTR Value V=If((V(R2,G)>2.5) | ((V(Q,G)<2.5) & (V(S2,G)<2.5)),5,100m)
SYMBOL res 1216 432 R90
WINDOW 0 0 56 VBottom 2
WINDOW 3 32 56 VTop 2
SYMATTR InstName R2
SYMATTR Value 30
SYMBOL cap 1232 512 R0
WINDOW 0 45 19 Left 2
WINDOW 3 48 46 Left 2
WINDOW 123 48 74 Left 2
SYMATTR InstName C2
SYMATTR Value 100p
SYMATTR Value2 IC=5
SYMBOL bv 720 896 R0
WINDOW 0 50 50 Left 2
WINDOW 3 67 218 Left 2
SYMATTR InstName BQ2
SYMATTR Value V=If((V(R1,G)<2.5) & ((V(S1,G)>2.5) | (V(Qb,G)<2.5)),5,100m)
SYMBOL res 864 832 R90
WINDOW 0 0 56 VBottom 2
WINDOW 3 32 56 VTop 2
SYMATTR InstName R3
SYMATTR Value 100
SYMBOL cap 880 912 R0
WINDOW 0 45 19 Left 2
WINDOW 3 48 46 Left 2
WINDOW 123 48 74 Left 2
SYMATTR InstName C3
SYMATTR Value 70p
SYMATTR Value2 IC=0
SYMBOL bv 1072 896 R0
WINDOW 0 45 58 Left 2
WINDOW 3 -60 184 Left 2
SYMATTR InstName BQB2
SYMATTR Value V=If((V(R1,G)>2.5) | ((V(Q1,G)<2.5) & (V(S1,G)<2.5)),5,100m)
SYMBOL res 1216 832 R90
WINDOW 0 0 56 VBottom 2
WINDOW 3 32 56 VTop 2
SYMATTR InstName R4
SYMATTR Value 100
SYMBOL cap 1232 912 R0
WINDOW 0 45 19 Left 2
WINDOW 3 48 46 Left 2
WINDOW 123 48 74 Left 2
SYMATTR InstName C4
SYMATTR Value 70p
SYMATTR Value2 IC=5
TEXT -360 752 Left 2 ;20-ns delay in A8 to fix a logic \nglitch when the two flip-flops toggle.

uvlo.asc, the sub-circuit schematic file:
Version 4.1
SHEET 1 880 680
WIRE 64 288 -144 288
WIRE 272 304 208 304
WIRE 64 320 16 320
WIRE -144 352 -144 288
WIRE -144 496 -144 432
WIRE 128 496 128 352
WIRE 128 496 -144 496
WIRE 128 528 128 496
FLAG 16 320 IN
IOPIN 16 320 In
FLAG 272 304 OUT
IOPIN 272 304 Out
FLAG 128 528 GNDT
IOPIN 128 528 BiDir
SYMBOL voltage -144 336 R0
WINDOW 0 47 39 Left 2
WINDOW 3 44 71 Left 2
SYMATTR InstName V1
SYMATTR Value {UVLOH}
SYMBOL TOF\\Subcircuits\\COMPTOF_G 128 304 R0
WINDOW 0 -50 -49 Bottom 2
SYMATTR InstName X2
SYMATTR SpiceLine VHIGH=5 VLOW=100m VHYS=VHYS
TEXT -144 80 Left 2 !*\n; .param UVLOH=10 ; turn-on level\n; .param UVLOL=8 ; turn-off level\n.param VHYS={UVLOH-UVLOL}\n*

optotof.asc, the sub-circuit schematic file:
Version 4
SHEET 1 892 680
WIRE -48 32 -128 32
WIRE 80 32 32 32
WIRE 384 32 224 32
WIRE 528 32 384 32
WIRE 624 32 528 32
WIRE 816 32 704 32
WIRE 80 80 80 32
WIRE 224 80 224 32
WIRE 384 80 384 32
WIRE 528 80 528 32
WIRE 80 208 80 160
WIRE 80 208 -128 208
WIRE 224 208 224 160
WIRE 384 208 384 144
WIRE 384 208 224 208
WIRE 528 208 528 144
WIRE 528 208 384 208
WIRE 816 208 528 208
FLAG -128 32 A
IOPIN -128 32 In
FLAG -128 208 K
IOPIN -128 208 In
FLAG 816 32 C
IOPIN 816 32 Out
FLAG 816 208 E
IOPIN 816 208 Out
SYMBOL f 224 80 R0
WINDOW 0 44 11 Left 2
WINDOW 3 40 47 Left 2
WINDOW 38 44 79 Left 2
SYMATTR InstName F1
SYMATTR Value {CTR}
SYMATTR SpiceModel Vf
SYMBOL res 48 16 R90
WINDOW 0 0 56 VBottom 2
WINDOW 3 32 56 VTop 2
SYMATTR InstName rd
SYMATTR Value {rd}
SYMBOL voltage 80 64 R0
WINDOW 0 47 46 Left 2
WINDOW 3 47 69 Left 2
WINDOW 123 0 0 Left 0
WINDOW 39 0 0 Left 0
SYMATTR InstName Vf
SYMATTR Value 1.05
SYMBOL voltage 720 32 R90
WINDOW 0 -32 56 VBottom 2
WINDOW 3 32 56 VTop 2
SYMATTR InstName V1
SYMATTR Value 100m
SYMBOL cap 368 80 R0
WINDOW 0 47 16 Left 2
WINDOW 3 46 43 Left 2
SYMATTR InstName C1
SYMATTR Value {Copto}
SYMBOL diode 512 144 M180
WINDOW 0 43 47 Left 2
WINDOW 3 44 21 Left 2
SYMATTR InstName D1
SYMATTR Value Dopto
TEXT -128 -96 Left 2 !.model Dopto D tt=100n Rs=10m N=100m\n.model DLED D N=1

The netlist it stands for:
* LLC VM cbc - bootstrap.asc
D3 N004 N005 DTOF
D4 N011 N005 DTOF
R6 N005 N010 50m
C5 N010 0 2.2m
R7 Vout 0 2.4
Rsec 0 N009 20m
Lm N007 Cr 1.6m
C6 Cr 0 22n IC={Vin/2}
Rprim N007 N006 100m
L1 HB N006 130µ
V4 N001 0 {Vin}
X§X5 N007 Cr N011 N009 N004 xfmr_ctap params: ratio=159m
Rlower N016 0 {Rlower}
Rupper Vout N016 {Rupper}
RLED Vout N014 {RLED}
C8 N016 N015 {C1}
C9 FB 0 {Ccol}
V1 N005 Vout 0
Vcc N012 0 12
M1 N001 G1 HB HB SPA11N60C3
M2 HB G2 0 0 SPA11N60C3
R1 G2 N013 10
D1 G2 N013 1N5817
D2 N012 N008 RF305BM6S
R2 N003 N002 10
D5 N003 N002 1N5817
B1 N002 HB V=IF( V(UVLO,HB)>2.5 & V(GU)>2.5, V(Vdd,HB), 100m)
Cboot HB Vdd 0.1µ IC=0
Vg N003 G1 0
R3 HB 0 1G
R4 Vdd N008 2.2
Bcons Vdd HB I=IF( V(UVLO,HB)>2.5, I(Vg)+{Icc},1u)
X§X1 FB N013 GU 0 generic_llc_vm params: Fswmin={Fswmin} Fswmax={Fswmax} DT={DT} Rpullup={Rpullup} VDRV={VDRV}
X§X4 Vdd HB UVLO uvlo params: UVLOH={UVLOH} UVLOL={UVLOL}
X§X6 N014 N015 FB 0 optotof params: rd=100 CTR={CTR} Copto={Copto}
X§X2 0 N016 N015 TL431TOF  ; pins A REF K

* block symbol definitions
.subckt xfmr_ctap 1 2 3 4 5
B1 1 2 I=(I(V1)+I(V2))*{ratio}
B2 N003 3 V=V(1,2)*{ratio}
V1 N003 N004 0
R1 4 N004 1µ
R2 1 2 1Meg
B3 N001 4 V=V(1,2)*{ratio}
V2 N001 N002 0
R3 5 N002 1µ
.ends xfmr_ctap

.subckt generic_llc_vm FB GL GU SU
B1 N001 SU V=IF(V(G1,GNDT)>2.5,{VDRV},100m)
B2 N002 GNDT V=IF(V(G2,GNDT)>2.5,{VDRV},100m)
R1 GL N002 10
C1 GL GNDT 10p
R2 GU N001 10
C2 GU SU 10p
R3 GNDT 0 1m
X§X2 FB GNDT G1 G2 vco_pulldown_subckt params: Fswmin={Fswmin} Fswmax={Fswmax} Rpullup={Rpullup} DT={DT}
.ends generic_llc_vm

.subckt vco_pulldown_subckt FB GNDT OUTA OUTB
A1 GNDT N007 GNDT N008 GNDT GNDT OUTA GNDT AND Vhigh=5 Vlow=0 Ref=2.5
A2 GNDT N007 GNDT N006 GNDT GNDT OUTB GNDT AND Vhigh=5 Vlow=0 Ref=2.5
A3 GNDT N010 GNDT N010 GNDT N007 N005 GNDT AND Vhigh=5 Vlow=0 Ref=2.5
V1 N012 GNDT 1
D1 N012 N009 DTOF2
R1 N007 N009 1k
G1 N011 GNDT N005 GNDT {IDT}
C1 N011 GNDT {Ct} IC=0
I1 GNDT N011 {IFMIN}
SW1 GNDT N001 N005 GNDT VCOSW
G3 GNDT N011 N001 GNDT {G2}
SW2 N001 N002 N007 GNDT VCOSW
E1 N002 GNDT N003 GNDT 1
E2 N003 GNDT N004 FB 1
V3 N004 GNDT {VFBmax}
R4 FB N004 {Rpullup}
X§X2 N009 N011 N010 GNDT comptof_g params: VHIGH=5 VLOW=1m VHYS=1u
X§X3 N006 N005 N008 N006 GNDT d_flipflop_g
*
.model DTOF2 D(TT=10n Rs=10m Cjo=10p Vfwd=1m Vrev=2)
.model VCOSW SW(Ron=10 Roff=100Meg Vt=2 Vh=1)
*
*
*
.param VFBmax=5 ; this is the maximum feedback voltage to get Fswmax
*
.param Ct=10p
.param Vswing=2.008 ; Timing capacitor final swing
.param IFMIN={Ct*Vswing/((1/Fswmin)-DT)} ; charging current when VFB = 0 V
.param IDT={-(IFMIN-Ct*Vswing/DT)/5}
.param G2={-(IFMIN+Ct*Vswing/(DT-(1/Fswmax)))/VFBmax}
*
* Parameters to be passed are:
* Fswmin=120k ; the LLC network will see half this value
* Fswmax=500k ; the LLC network will see half this value
* DT=10n ; this is the dead time value
* Pullup=20k ; this is the internal pull-up resistance
.ends vco_pulldown_subckt

.subckt comptof_g INV NINV OUT G
B1 HYS NINV V=IF(V(out) > ({VHIGH}+{VLOW})/2,{VHYS},0)
B2 N001 G V=IF(V(HYS,INV)>0,{VHIGH},{VLOW})
R1 N001 OUT 10
C1 OUT G 10p
R2 INV G 1Meg
.ends comptof_g

.subckt d_flipflop_g D CLK Q Qb G
A1 G Q1 G CLK G G S2 G AND Vhigh=5 Vlow=100m Ref=2.5
A3 G CLK G QB1 G G R2 G AND Vhigh=5 Vlow=100m Ref=2.5
A6 G D G N003 G G S1 G AND Vhigh=5 Vlow=100m Ref=2.5
A7 G N004 G N003 G G R1 G AND Vhigh=5 Vlow=100m Ref=2.5
A8 G D G D G N004 G G AND Vhigh=5 Vlow=100m Ref=2.5 Td=20n
A9 G CLK G CLK G N003 G G AND Vhigh=5 Vlow=100m Ref=2.5
BQ1 N001 G V=If((V(R2,G)<2.5) & ((V(S2,G)>2.5) | (V(Qb,G)<2.5)),5,100m)
R1 Q N001 30
C1 Q G 100p IC=0
BQB1 N002 G V=If((V(R2,G)>2.5) | ((V(Q,G)<2.5) & (V(S2,G)<2.5)),5,100m)
R2 Qb N002 30
C2 Qb G 100p IC=5
BQ2 N005 G V=If((V(R1,G)<2.5) & ((V(S1,G)>2.5) | (V(Qb,G)<2.5)),5,100m)
R3 Q1 N005 100
C3 Q1 G 70p IC=0
BQB2 N006 G V=If((V(R1,G)>2.5) | ((V(Q1,G)<2.5) & (V(S1,G)<2.5)),5,100m)
R4 QB1 N006 100
C4 QB1 G 70p IC=5
* 20-ns delay in A8 to fix a logic
* glitch when the two flip-flops toggle.
.ends d_flipflop_g

.subckt uvlo IN GNDT OUT
V1 N001 GNDT {UVLOH}
X§X2 N001 IN OUT GNDT comptof_g params: VHIGH=5 VLOW=100m VHYS=VHYS
*
; .param UVLOH=10 ; turn-on level
; .param UVLOL=8 ; turn-off level
.param VHYS={UVLOH-UVLOL}
*
.ends uvlo

.subckt optotof A K C E
F1 N002 E Vf {CTR}
rd N001 A {rd}
Vf N001 K 1.05
V1 C N002 100m
C1 N002 E {Copto}
D1 E N002 Dopto
.model Dopto D tt=100n Rs=10m N=100m
.model DLED D N=1
.ends optotof

.model D D
.lib standard.dio
.model NMOS NMOS
.model PMOS PMOS
.lib standard.mos
.tran 0 6.05m 6m 100n uic
.MODEL TOFSW2 SW(Ron=10m Roff=100Meg Vt=2 Vh=1)
.MODEL DTOF D(IS=10e-18 RS=16m CJO=50p N=100m)
*
.param Vin=400
*
* LLC controller parameters
*
.param DT=120n ; deadtime for the MOSFETs
.param Fswmin=120k
.param Fswmax=500k
.param VDRV=12
.param Rpullup=20k
*
.options abstol=1u vntol=1m reltol=0.01 gmin=1n
+method=gear
*
.param Gfc=-1 ; magnitude at crossover
.param PS=-80 ; phase lag at crossover
*
*
* Enter Design Goals Information Here *
*
.param fc=2k ; targeted crossover
.param PM=70 ; choose phase margin at crossover
*
* Pole-zero calculations *
*
.param boost=PM-PS-90
.param fp={(tan(boost*pi/180)+sqrt((tan(boost*pi/180))**2+1))*fc}
.param fz={fc**2/fp}
*
* Enter the Values for Vout and Bridge Bias Current *
*
.param Vout=24
.param Ibias=2m
.param Vref=2.5
.param Rlower={Vref/Ibias}
.param Rupper={(Vout-Vref)/Ibias}
*
* Optocoupler specifications *
*
.param Fopto=15k
.param Copto={1/(2*pi*Fopto*Rpullup)}
.param CTR=0.85
*
.param VL=2.5
.param VCEsat=0.3
.param Vdd=5 ; internal pullup voltage in the IC
.param Ib=1m ; bias current for the TL431
.param Vf=1
.param A={Vout-Vf-VL}
.param B={Vdd-VCEsat+Ib*CTR*Rpullup}
.param Rmax={(A/B)*Rpullup*CTR}
*
* Do not edit the below lines *
*
.param G={10**(-Gfc/20)}
.param RLED={CTR*Rpullup/G}
.param C1={1/(2*pi*fz*Rupper)}
.param C2={1/(2*pi*fp*Rpullup)}
.param Ccol={C2-Copto}
*
*
* Bootstrap specs *
.param UVLOH=10 ; turn-on level
.param UVLOL=8 ; turn-off level
.param Icc=1m ; static driver consumption
*
.backanno
.end